# Altium schematic sheet STE2007_Nokia 1202.SchDoc
size A4
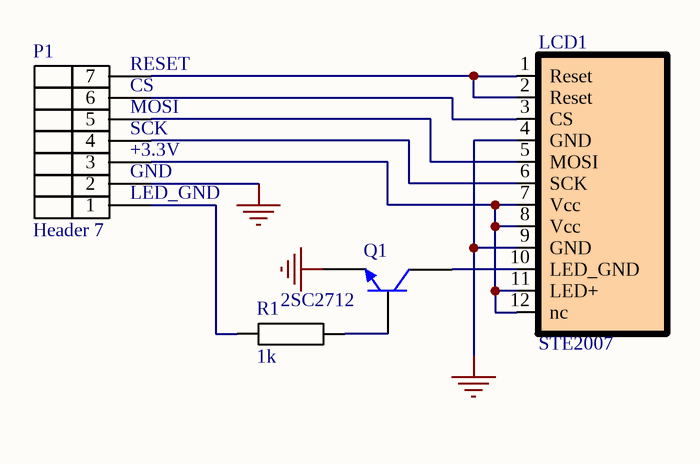
[diagram p0: STE2007_Nokia 1202.SchDoc]

## Parts
LCD1  STE2007  [Display_Nokia 1202]
P1  Header 7  [HDR1X7]
Q1  2SC2712  [SOT23_N]
R1  1k  [6-0805_N]

## Nets
GND: LCD1.4(GND) LCD1.9(GND) P1.2 Q1.2(E)
NetLCD1_1: LCD1.1(Reset) LCD1.2(Reset) P1.7
NetLCD1_3: LCD1.3(CS) P1.6
NetLCD1_5: LCD1.5(MOSI) P1.5
NetLCD1_6: LCD1.6(SCK) P1.4
NetLCD1_7: LCD1.7(Vcc) LCD1.8(Vcc) LCD1.11(LED+) LCD1.12(nc) P1.3
NetLCD1_10: LCD1.10(LED_GND) Q1.3(C)
NetP1_1: P1.1 R1.1
NetQ1_1: Q1.1(B) R1.2

## Notes on the sheet
- (near P1) CS
- (near P1) SCK
- (near P1) MOSI
- (near P1) RESET
- (near P1) LED_GND
- (near P1) +3.3V
- (near P1) GND

## Library data of the parts
LCD1 = Display_Nokia 1202
P1 = Header 7: Header, 7-Pin; LatestRevisionDate: 17-Jul-2002; LatestRevisionNote: Re-released for DXP Platform.; Publisher: Altium Limited
Q1 = 2SC2712: NPN